# Altium project phDoserController.PrjPcb
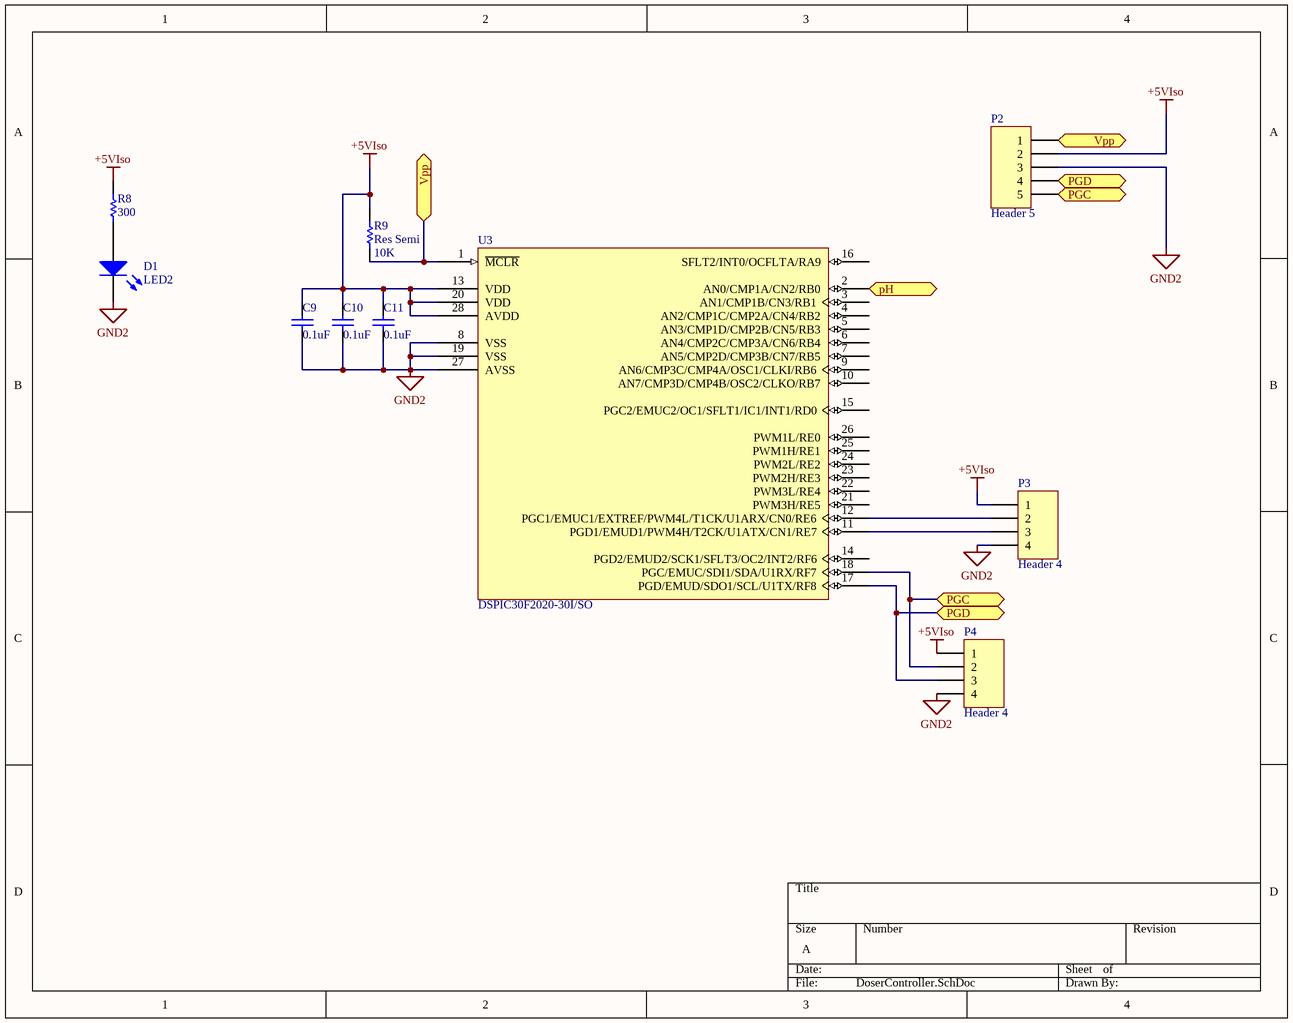
[diagram p0: DoserController.SchDoc]
2 sheets, 28 parts. Net scope: flat (ports and power ports of the same name join across sheets).
Board file: phDoser.PcbDoc
Sheets:
  DoserController.SchDoc
  pHCircuit.SchDoc

## Sheet DoserController.SchDoc
size A

### Parts
C9  value 0.1uF  [RESC2012L]  (hidden comment: Cap)
C10  value 0.1uF  [RESC2012L]  (hidden comment: Cap)
C11  value 0.1uF  [RESC2012L]  (hidden comment: Cap)
D1  LED2  [DSO-C2/D5.6]
P2  Header 5  [HDR1X5]
P3  Header 4  [HDR1X4]
P4  Header 4  [HDR1X4]
R8  value 300  [RESC2012L]  (hidden comment: Res1)
R9  Res Semi  value 10K  [RESC2012L]
U3  DSPIC30F2020-30I/SO  [SOIC-SO28_N]

### Ports
PGC, PGD, pH, Vpp

### Nets
+5VIso: C9.2 C10.2 C11.2 P2.2 P3.1 P4.1 R8.2 R9.2 U3.13(VDD) U3.20(VDD) U3.28(AVDD)
GND2: C9.1 C10.1 C11.1 D1.2(K) P2.3 P3.4 P4.4 U3.8(VSS) U3.19(VSS) U3.27(AVSS)
NetD1_1: D1.1(A) R8.1
NetP2_1: P2.1 R9.1 U3.1(~{MCLR}) ; port Vpp
NetP2_4: P2.4 P4.3 U3.17(PGD/EMUD/SDO1/SCL/U1TX/RF8) ; port PGD
NetP2_5: P2.5 P4.2 U3.18(PGC/EMUC/SDI1/SDA/U1RX/RF7) ; port PGC
NetP3_2: P3.2 U3.12(PGC1/EMUC1/EXTREF/PWM4L/T1CK/U1ARX/CN0/RE6)
NetP3_3: P3.3 U3.11(PGD1/EMUD1/PWM4H/T2CK/U1ATX/CN1/RE7)
NetR1_1: U3.2(AN0/CMP1A/CN2/RB0) ; port pH

Not connected (* = marked no-connect by the designer): U3 3(AN1/CMP1B/CN3/RB1) 4(AN2/CMP1C/CMP2A/CN4/RB2) 5(AN3/CMP1D/CMP2B/CN5/RB3) 6(AN4/CMP2C/CMP3A/CN6/RB4) 7(AN5/CMP2D/CMP3B/CN7/RB5) 9(AN6/CMP3C/CMP4A/OSC1/CLKI/RB6) 10(AN7/CMP3D/CMP4B/OSC2/CLKO/RB7) 14(PGD2/EMUD2/SCK1/SFLT3/OC2/INT2/RF6) 15(PGC2/EMUC2/OC1/SFLT1/IC1/INT1/RD0) 16(SFLT2/INT0/OCFLTA/RA9) 21(PWM3H/RE5) 22(PWM3L/RE4) 23(PWM2H/RE3) 24(PWM2L/RE2) 25(PWM1H/RE1) 26(PWM1L/RE0)

### Library data of the parts
C9-C11 = Cap: Capacitor; Published: 8-Jun-2000; LatestRevisionDate: 17-Jul-2002; LatestRevisionNote: Re-released for DXP Platform.; PackageReference: RAD-0.3; Publisher: Altium Limited
D1 = LED2: Typical RED, GREEN, YELLOW, AMBER GaAs LED; Published: 8-Jun-2000; LatestRevisionDate: 17-Jul-2002; LatestRevisionNote: Re-released for DXP Platform.; PackageVersion: Feb-2002; PackageReference: 3.2X1.6X1.1; Publisher: Altium Limited
P2 = Header 5: Header, 5-Pin; LatestRevisionDate: 17-Jul-2002; LatestRevisionNote: Re-released for DXP Platform.; Publisher: Altium Limited
P3 P4 = Header 4: Header, 4-Pin; LatestRevisionDate: 17-Jul-2002; LatestRevisionNote: Re-released for DXP Platform.; Publisher: Altium Limited
R8 = Res1: Resistor; Published: 8-Jun-2000; LatestRevisionDate: 17-Jul-2002; LatestRevisionNote: Re-released for DXP Platform.; PackageReference: AXIAL-0.3; Publisher: Altium Limited
R9 = Res Semi: Semiconductor Resistor; Published: 8-Jun-2000; LatestRevisionDate: 17-Jul-2002; LatestRevisionNote: Re-released for DXP Platform.; PackageReference: AXIAL-0.5; Publisher: Altium Limited
U3 = DSPIC30F2020-30I/SO: High-Performance 16-bit Digital Signal Controller with Switch Mode Power Supply, 12 KB Flash, 512 Byte SRAM, 28-Pin SOIC, Industrial Temperature; FirstPublished: 29-Jan-2009; DatasheetVersion: revC, Nov-2006; PackageVersion: revBB, Aug-2009; PackageReference: SOIC-SO28; Publisher: Altium Limited; PackageDescription: 28-Lead Plastic Small Outline (SO) - Wide 7.50mm Body [SOIC]; Supplier 1: Digi-Key; Supplier Part Number 1: DSPIC30F2020-30I/SO-ND; Supplier 2: Farnell; Supplier Part Number 2: 1332026; Supplier 3: Newark; Supplier Part Number 3: 88K3882; Code_JEDEC: MS-013; ComponentLink1Description: Datasheet; ComponentLink1URL: http://ww1.microchip.com/downloads/en/DeviceDoc/70178C.pdf; ComponentLink2Description: Packaging Specification; ComponentLink2URL: http://www.microchip.com/stellent/groups/techpub_sg/documents/packagingspec/en012702.pdf; ComponentLink3Description: Microchip.com Home; ComponentLink3URL: http://www.microchip.com/

## Sheet pHCircuit.SchDoc
size A
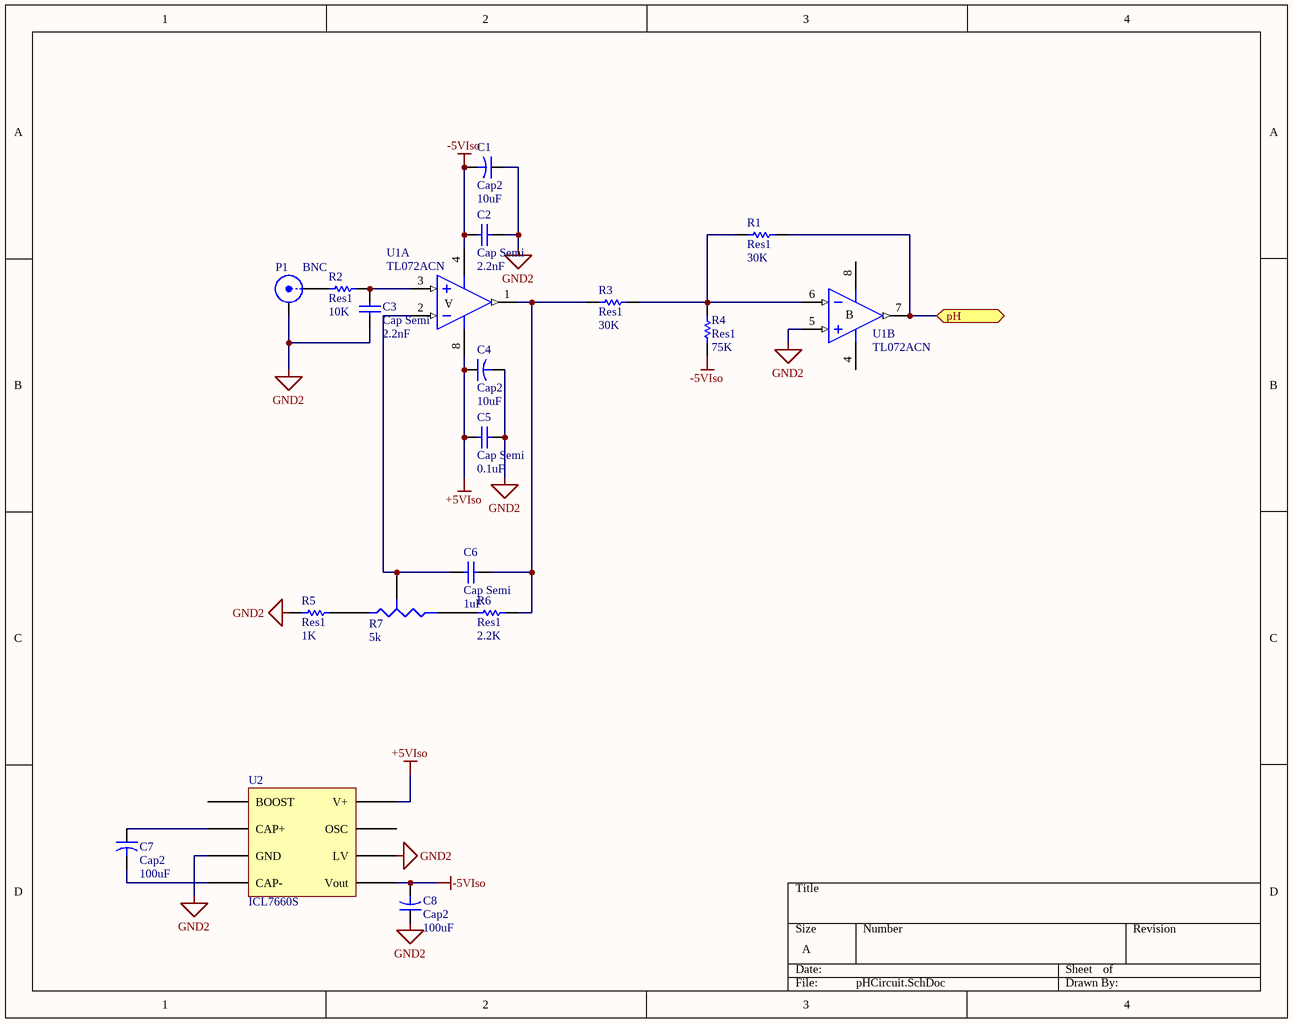
[diagram p1: pHCircuit.SchDoc]

### Parts
C1  Cap2  value 10uF  [CAPC3216L]
C2  Cap Semi  value 2.2nF  [RESC2012L]
C3  Cap Semi  value 2.2nF  [RESC2012L]
C4  Cap2  value 10uF  [CAPC3216L]
C5  Cap Semi  value 0.1uF  [RESC2012L]
C6  Cap Semi  value 1uF  [RESC2012L]
C7  Cap2  value 100uF  [CAPC3216L]
C8  Cap2  value 100uF  [CAPC3216L]
P1  BNC  [BNC_RA CON]
R1  Res1  value 30K  [RESC2012L]
R2  Res1  value 10K  [RESC2012L]
R3  Res1  value 30K  [RESC2012L]
R4  Res1  value 75K  [RESC2012L]
R5  Res1  value 1K  [RESC2012L]
R6  Res1  value 2.2K  [RESC2012L]
R7  5k  [R25_turn_Top]
U1  TL072ACN  [DIP8]  (parts A,B of 2)
U2  ICL7660S  [DIP8]

### Ports
pH

### Nets
+5VIso: C4.1 C5.2 U1.8(V+) U2.8(V+)
-5VIso: C1.2 C2.2 C8.2 R4.1 U1.4(V-) U2.5(Vout)
GND2: C1.1 C2.1 C3.1 C4.2 C5.1 C8.1 P1.2(Y) R5.2 U1.5(IN+) U2.3(GND) U2.6(LV)
NetC3_2: C3.2 R2.1 U1.3(IN+)
NetC6_1: C6.1 R3.2 R6.1 U1.1(OUT)
NetC6_2: C6.2 R7.3(TAP) U1.2(IN-)
NetC7_1: C7.1 U2.2(CAP+)
NetC7_2: C7.2 U2.4(CAP-)
NetP1_1: P1.1(X) R2.2
NetR1_1: R1.1 U1.7(OUT) ; port pH
NetR1_2: R1.2 R3.1 R4.2 U1.6(IN-)
NetR5_1: R5.1 R7.1(A)
NetR6_2: R6.2 R7.2(B)

Not connected (* = marked no-connect by the designer): U2 1(BOOST) 7(OSC)

### Notes on the sheet
- (in symbol TL072ACN, part A) A
- (in symbol TL072ACN, part B) B

### Library data of the parts
C1 C4 C7 C8 = Cap2: Capacitor; Published: 23-Sep-2002; PackageReference: CAPR5-4X5; Publisher: Altium Limited
C2 C3 C5 C6 = Cap Semi: Capacitor (Semiconductor SIM Model); Published: 8-Jun-2000; LatestRevisionDate: 29-May-2009; LatestRevisionNote: IPC-7351 Footprint Added.; PackageReference: C1206; Publisher: Altium Limited; PackageDescription: Chip Capacitor
P1 = BNC: BNC Elbow Connector; LatestRevisionDate: 17-Jul-2002; LatestRevisionNote: Re-released for DXP Platform.; Publisher: Altium Limited
R1-R6 = Res1: Resistor; Published: 8-Jun-2000; LatestRevisionDate: 17-Jul-2002; LatestRevisionNote: Re-released for DXP Platform.; PackageReference: AXIAL-0.3; Publisher: Altium Limited
R7 = R25_turn
U1 = TL072ACN: Low-Noise J-FET Dual Operational Amplifier; Published: 24-Aug-2001; LatestRevisionDate: 06-Jun-2005; LatestRevisionNote: Stylized 3D Model Added.; DatasheetVersion: Dec-1998; PackageReference: DIP8; Publisher: Altium Limited; PackageDescription: DIP; 8 Leads; Row Spacing 7.62 mm; Pitch 2.54 mm; Code_JEDEC: MO-001-AN; ComponentLink1Description: Manufacturer Link; ComponentLink1URL: http://www.st.com/; ComponentLink2Description: Datasheet; ComponentLink2URL: http://www.st.com/stonline/products/literature/ds/2298/tl072.pdf

## Nets that join several sheets
+5VIso: DoserController (11 pins), pHCircuit (C4.1 C5.2 U1.8 U2.8)
GND2: DoserController (10 pins), pHCircuit (11 pins)
NetR1_1: DoserController (U3.2), pHCircuit (R1.1 U1.7)